# Altium schematic sheet HVSchematic_Rev2.SchDoc
size A
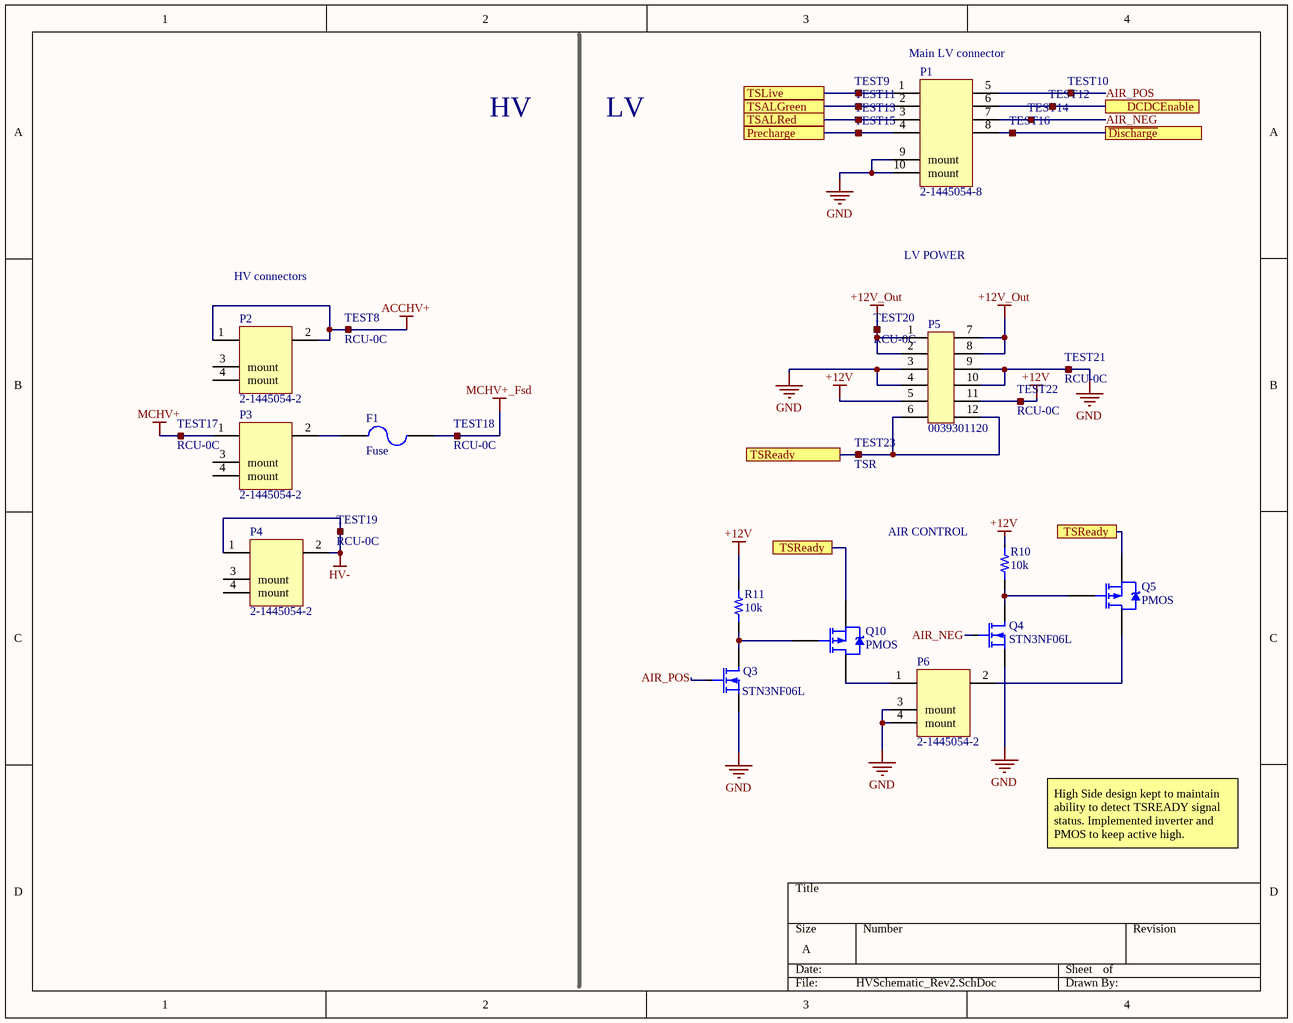
[diagram p0: HVSchematic_Rev2.SchDoc]

## Parts
F1  Fuse  [0885004.DR]
P1  2-1445054-8  [2-1445054-8]
P2  2-1445054-2  [2-1445054-2]
P3  2-1445054-2  [2-1445054-2]
P4  2-1445054-2  [2-1445054-2]
P5  0039301120  [0039301120]
P6  2-1445054-2  [2-1445054-2]
Q3  STN3NF06L  [STN3NF06L]
Q4  STN3NF06L  [STN3NF06L]
Q5  PMOS  [SOT-23 (TO-236)]
Q10  PMOS  [SOT-23 (TO-236)]
R10  value 10k  [RES 0402/1005]  (hidden comment: Resistor 1.0 0402 1/10W 1%)
R11  value 10k  [RES 0402/1005]  (hidden comment: Resistor 1.0 0402 1/10W 1%)
TEST8  RCU-0C  [RCU-0C]
TEST9  TSL  [RCU-0C]  (value not drawn)
TEST10  AIR_POS  [RCU-0C]  (value not drawn)
TEST11  TSALGreen Out  [RCU-0C]  (value not drawn)
TEST12  RCU-0C  [RCU-0C]  (value not drawn)
TEST13  TSRED  [RCU-0C]  (value not drawn)
TEST14  AIR_NEG  [RCU-0C]  (value not drawn)
TEST15  PC  [RCU-0C]  (value not drawn)
TEST16  DC  [RCU-0C]  (value not drawn)
TEST17  RCU-0C  [RCU-0C]
TEST18  RCU-0C  [RCU-0C]
TEST19  RCU-0C  [RCU-0C]
TEST20  RCU-0C  [RCU-0C]
TEST21  RCU-0C  [RCU-0C]
TEST22  RCU-0C  [RCU-0C]
TEST23  TSR  [RCU-0C]

## Ports
DCDCEnable, Precharge, TSALGreen, TSALRed, TSLive, TSReady, ~{Discharge}

## Nets
+12V: P5.5 P5.11 R10.2 R11.2 TEST22.1
+12V_Out: P5.1 P5.2 P5.7 P5.8 TEST20.1
ACCHV+: P2.1 P2.2 TEST8.1
GND: P1.9(mount) P1.10(mount) P5.3 P5.4 P5.9 P5.10 P6.3(mount) P6.4(mount) Q3.3(S) Q4.3(S) TEST21.1
HV-: P4.1 P4.2 TEST19.1
MCHV+: P3.1 TEST17.1
MCHV+_Fsd: F1.2 TEST18.1
~{Discharge}: P1.8 TEST16.1 ; port ~{Discharge}
AIR_NEG: P1.7 Q4.1(G) TEST14.1
AIR_POS: P1.5 Q3.1(G) TEST10.1
DCDCEnable: P1.6 TEST12.1 ; port DCDCEnable
Precharge: P1.4 TEST15.1 ; port Precharge
TSALGreen: P1.2 TEST11.1 ; port TSALGreen
TSALRed: P1.3 TEST13.1 ; port TSALRed
TSLive: P1.1 TEST9.1 ; port TSLive
TSReady: P5.6 P5.12 Q5.2(S) Q10.2(S) TEST23.1 ; port TSReady
NetF1_1: F1.1 P3.2
NetP6_1: P6.1 Q10.3(D)
NetP6_2: P6.2 Q5.3(D)
NetQ3_2: Q3.2(D) Q10.1(G) R11.1
NetQ4_2: Q4.2(D) Q5.1(G) R10.1

Not connected (* = marked no-connect by the designer): P2 3(mount) 4(mount); P3 3(mount) 4(mount); P4 3(mount) 4(mount)

## Notes on the sheet
- (near P1) Main LV connector
- HV
- LV
- HV connectors
- LV POWER
- AIR CONTROL
- High Side design kept to maintain ability to detect TSREADY signal status. Implemented inverter and PMOS to keep active high.

## Library data of the parts
F1 = 7: Manufacturer_id: 1; idFuse: 7; Value: 4A; V_max: 450VDC; Pd_Typ: 316mW; Created_By: Graydon; Drawer_id: 1; Name: 0885004.DR; I_hold: 4A; MfrPartNo: 0885004.DR; Link: https://www.digikey.com/product-detail/en/littelfuse-inc/0885004.DR/F10991CT-ND/8345705; Created_Date: 11/12/2018
P1 = 12: 1x8 connector; Manufacturer_id: 5; idConn: 12; Drawer_id: 1; Name: Micro MATE-N-LOK 1x8; Num_Contacts: 8; Created_By: Graydon; Num_Rows: 1; MfrPartNo: 2-1445054-8; Link: https://www.digikey.com/product-detail/en/te-connectivity-amp-connectors/2-1445054-8/2-1445054-8-ND/1890093; ComponentLink1Description: Datasheet; Supplier1: Digi-Key; Supplier1PartNo: 2-1445054-8-ND; Created_Date: 11/10/2018
P2-P4 P6 = 16: 1x2 connector; Manufacturer_id: 5; idConn: 16; Drawer_id: 1; Name: Micro MATE-N-LOK 1x2; Voltage_Rating: Null; Num_Contacts: 2; Created_By: Graydon; Num_Rows: 1; Pitch: Null; MfrPartNo: 2-1445054-2; Link: https://www.digikey.com/products/en?keywords=2-1445054-2; ComponentLink1Description: Digikey; ComponentLink1URL: Null; Supplier1: Digi-Key; Supplier1PartNo: 2-1445054-2-ND; Created_Date: 11/12/2018; Updated_By: Null
P5 = 20: Molex Minifit Jr 12p right angle; Manufacturer_id: 1; idConn: 20; Value: CONN; Num_Contacts: 12; Num_Rows: 2; Created_By: Graydon; Drawer_id: 1; Name: Minifit Jr 12p; MfrPartNo: 0039301120; Link: https://www.digikey.com/product-detail/en/molex-llc/0039301120/WM1356-ND/561083; ComponentLink1Description: Datasheet; ComponentLink1URL: https://www.molex.com/pdm_docs/sd/039301120_sd.pdf; Supplier1: Digi-Key; Supplier1PartNo: https://www.digikey.com/product-detail/en/molex-llc/0039301120/WM1356-ND/561083; Created_Date: 11/28/2018
Q3 Q4 = 8: MOSFET N-CH 60V 4A SOT223; Manufacturer_id: 1; idFETs: 8; Value: N_Channel; Rds_On: 70m; Vgs(Max): +/- 16V; Power(Max): 3.3W; Created_By: Graydon; Drawer_id: 1; Name: STN3NF06L; Vdss: 60V; Num_Circuits: 1; Id: 4A; Package: SOT-233; MfrPartNo: STN3NF06L; Link: https://www.digikey.com/product-detail/en/stmicroelectronics/STN3NF06L/497-3177-1-ND/654516; ComponentLink1Description: Datasheet; ComponentLink1URL: https://www.st.com/content/ccc/resource/technical/document/datasheet/b1/52/93/f0/a9/a9/40/d7/CD00002430.pdf/files/CD00002430.pdf/jcr:content/translations/en.CD00002430.pdf; Supplier1: Digkey; Supplier1PartNo: 497-3177-1-ND; Created_Date: 11/26/2018
Q5 Q10 = 12: P-Channel 60V 170mA (Ta) 360mW (Ta) Surface Mount SOT-23-3; Manufacturer_id: 1; idFuse: 3; idFETs: 12; Value: P_Channel; Rds_On: 8 Ohm; Vgs(typ): 2V; Vgs(Max): 20V; Power(Max): 350mW; Created_By: Angel; Drawer_id: 1; Name: BSS84PH6327XTSA2; Vdss: 60V; Num_Circuits: 1; Id: 170mA; Package: SOT-23-3; MfrPartNo: BSS84PH6327XTSA2; Link: https://www.digikey.com/product-detail/en/infineon-technologies/BSS84PH6327XTSA2/BSS84PH6327XTSA2DKR-ND/5413783; Supplier1: Digi-Key; Supplier1PartNo: BSS84PH6327XTSA2DKR-ND
R10 R11 = 1: idResistor: 1; Name: Res_1.0_0402_1/10W_1%; Created_By: Nick Mah; Supplier 1: Digi-Key; Manufacturer_id: 1; Drawer_id: 1; Tolerance: 1%; Power: 1/10W; Package: 0402; ComponentLink1Description: Datasheet; Created_Date: 2018-10-20
TEST8-TEST23 = 14: Test point; Manufacturer_id: 1; idConn: 14; Value: CONN; Created_By: Graydon; Updated_By: Null; Drawer_id: 1; Name: RCU-0C; Num_Contacts: 1; Num_Rows: 1; Package: RCU-0C; MfrPartNo: RCU-0C; Link: https://www.digikey.com/product-detail/en/te-connectivity-amp-connectors/RCU-0C/A106145CT-ND/3477802; ComponentLink1Description: Null; ComponentLink1URL: Null; Supplier1: None; Supplier1PartNo: None; Created_Date: 11/10/2018